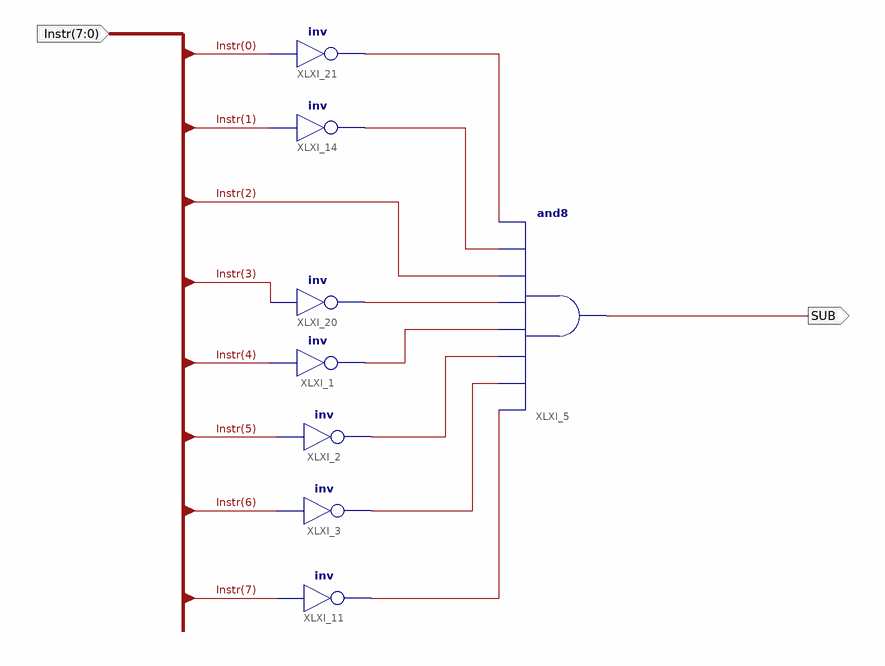
[diagram p0: schematic sheet 1]
// Xilinx ISE schematic instrSUB.sch (spartan3e) as structural Verilog: 8 symbols, 2 ports
module instrSUB (
  input  [7:0] Instr,
  output SUB
);

  wire XLXN_2, XLXN_3, XLXN_4, XLXN_5, XLXN_6, XLXN_16, XLXN_17;

  not XLXI_1 (XLXN_2, Instr[4]);
  not XLXI_2 (XLXN_3, Instr[5]);
  not XLXI_3 (XLXN_4, Instr[6]);
  not XLXI_11 (XLXN_5, Instr[7]);
  and XLXI_5 (SUB, XLXN_5, XLXN_4, XLXN_3, XLXN_2, XLXN_16, Instr[2], XLXN_6, XLXN_17);
  not XLXI_14 (XLXN_6, Instr[1]);
  not XLXI_20 (XLXN_16, Instr[3]);
  not XLXI_21 (XLXN_17, Instr[0]);
endmodule
